# Altium schematic sheet FT2232Circuit.SchDoc
size A3
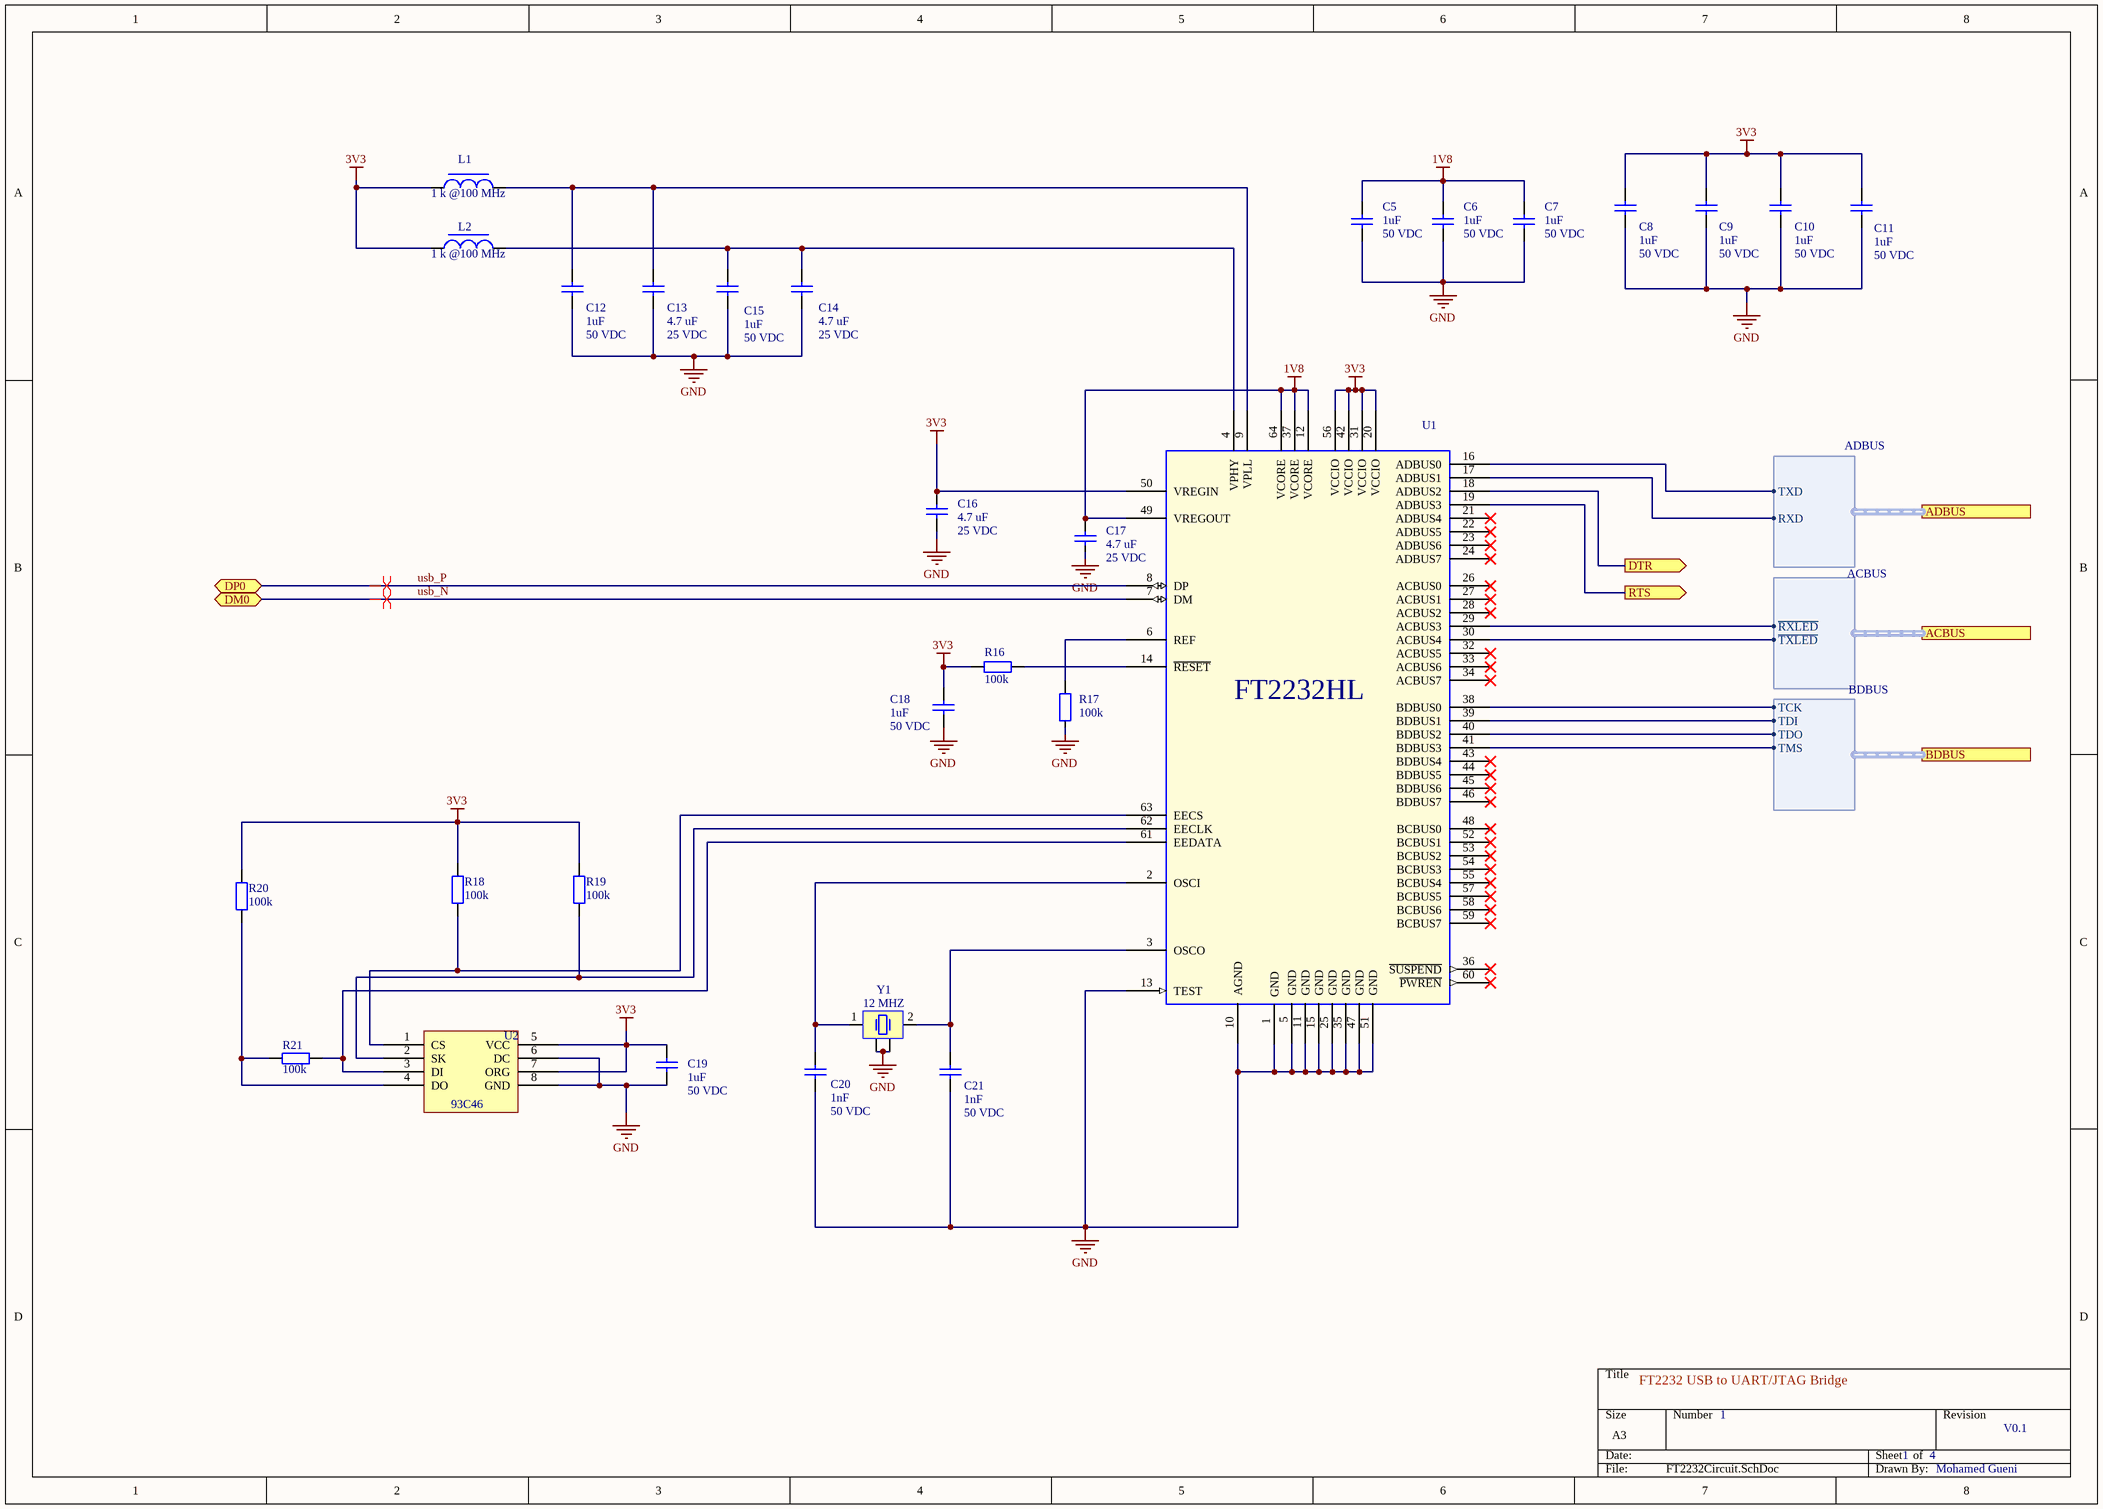
[diagram p0: FT2232Circuit.SchDoc]

## Parts
C5  Value 1: 1uF  Value 2: 50 VDC  [CAP-0603]  (hidden comment: Capacitor)
C6  Value 1: 1uF  Value 2: 50 VDC  [CAP-0603]  (hidden comment: Capacitor)
C7  Value 1: 1uF  Value 2: 50 VDC  [CAP-0603]  (hidden comment: Capacitor)
C8  Value 1: 1uF  Value 2: 50 VDC  [CAP-0603]  (hidden comment: Capacitor)
C9  Value 1: 1uF  Value 2: 50 VDC  [CAP-0603]  (hidden comment: Capacitor)
C10  Value 1: 1uF  Value 2: 50 VDC  [CAP-0603]  (hidden comment: Capacitor)
C11  Value 1: 1uF  Value 2: 50 VDC  [CAP-0603]  (hidden comment: Capacitor)
C12  Value 1: 1uF  Value 2: 50 VDC  [CAP-0603]  (hidden comment: Capacitor)
C13  Value 1: 4.7 uF  Value 2: 25 VDC  [CAP-0603]  (hidden comment: Capacitor)
C14  Value 1: 4.7 uF  Value 2: 25 VDC  [CAP-0603]  (hidden comment: Capacitor)
C15  Value 1: 1uF  Value 2: 50 VDC  [CAP-0603]  (hidden comment: Capacitor)
C16  Value 1: 4.7 uF  Value 2: 25 VDC  [CAP-0603]  (hidden comment: Capacitor)
C17  Value 1: 4.7 uF  Value 2: 25 VDC  [CAP-0603]  (hidden comment: Capacitor)
C18  Value 1: 1uF  Value 2: 50 VDC  [CAP-0603]  (hidden comment: Capacitor)
C19  Value 1: 1uF  Value 2: 50 VDC  [CAP-0603]  (hidden comment: Capacitor)
C20  Value 1: 1nF  Value 2: 50 VDC  [CAP-0603]  (hidden comment: Capacitor)
C21  Value 1: 1nF  Value 2: 50 VDC  [CAP-0603]  (hidden comment: Capacitor)
L1  Value 1: 1 k @100 MHz  [RESC3216X18N]  (hidden comment: MPZ1608S102A)
L2  Value 1: 1 k @100 MHz  [RESC3216X18N]  (hidden comment: MPZ1608S102A)
R16  Value 1: 100k  [R0603]  (hidden comment: Resistor)
R17  Value 1: 100k  [R0603]  (hidden comment: Resistor)
R18  Value 1: 100k  [R0603]  (hidden comment: Resistor)
R19  Value 1: 100k  [R0603]  (hidden comment: Resistor)
R20  Value 1: 100k  [R0603]  (hidden comment: Resistor)
R21  Value 1: 100k  [R0603]  (hidden comment: Resistor)
U1  FT2232HL-REEL  [TSQFP50P1200X1200X160-64N]  (value not drawn)
U2  93C46  [SOIC127P600X175-8N]  (value not drawn)
Y1  Value 1: 12 MHZ  [WE-4XTAL3.2x2.5mm]  (hidden comment: XTAL4)

## Ports
ACBUS (harness ACBUS), ADBUS (harness ADBUS), BDBUS (harness BDBUS), DM0 (bidir), DP0 (bidir), DTR (out), RTS (out)

## Harnesses
ADBUS: TXD, RXD
ACBUS: ~{RXLED}, ~{TXLED}
BDBUS: TCK, TDI, TDO, TMS

## Nets
1V8: C5.2 C6.2 C7.2 C17.2 U1.12(VCORE) U1.37(VCORE) U1.49(VREGOUT) U1.64(VCORE)
3V3: C8.2 C9.2 C10.2 C11.2 C16.2 C18.2 C19.2 L1.2 L2.2 R16.1 R18.2 R19.2 R20.2 U1.20(VCCIO) U1.31(VCCIO) U1.42(VCCIO) U1.50(VREGIN) U1.56(VCCIO) U2.5(VCC) U2.7(ORG)
GND: C5.1 C6.1 C7.1 C8.1 C9.1 C10.1 C11.1 C12.1 C13.1 C14.1 C15.1 C16.1 C17.1 C18.1 C19.1 C20.1 C21.1 R17.1 U1.1(GND) U1.5(GND) U1.10(AGND) U1.11(GND) U1.13(TEST) U1.15(GND) U1.25(GND) U1.35(GND) U1.47(GND) U1.51(GND) U2.6(DC) U2.8(GND) Y1.GND1 Y1.GND2
DTR: U1.18(ADBUS2) ; port DTR
RTS: U1.19(ADBUS3) ; port RTS
usb_N: U1.7(DM) ; port DM0
usb_P: U1.8(DP) ; port DP0
NetC12_2: C12.2 C13.2 L1.1 U1.9(VPLL)
NetC14_2: C14.2 C15.2 L2.1 U1.4(VPHY)
NetC20_2: C20.2 U1.2(OSCI) Y1.1(OSC1)
NetC21_2: C21.2 U1.3(OSCO) Y1.2(OSC2)
NetR16_2: R16.2 U1.14(~{RESET})
NetR17_2: R17.2 U1.6(REF)
NetR18_1: R18.1 U1.63(EECS) U2.1(CS)
NetR19_1: R19.1 U1.62(EECLK) U2.2(SK)
NetR20_1: R20.1 R21.2 U2.4(DO)
NetR21_1: R21.1 U1.61(EEDATA) U2.3(DI)
NetU1_16: U1.16(ADBUS0) ; port ADBUS.TXD
NetU1_17: U1.17(ADBUS1) ; port ADBUS.RXD
NetU1_29: U1.29(ACBUS3) ; port ACBUS.~{RXLED}
NetU1_30: U1.30(ACBUS4) ; port ACBUS.~{TXLED}
NetU1_38: U1.38(BDBUS0) ; port BDBUS.TCK
NetU1_39: U1.39(BDBUS1) ; port BDBUS.TDI
NetU1_40: U1.40(BDBUS2) ; port BDBUS.TDO
NetU1_41: U1.41(BDBUS3) ; port BDBUS.TMS

Not connected (* = marked no-connect by the designer): U1 21(ADBUS4)* 22(ADBUS5)* 23(ADBUS6)* 24(ADBUS7)* 26(ACBUS0)* 27(ACBUS1)* 28(ACBUS2)* 32(ACBUS5)* 33(ACBUS6)* 34(ACBUS7)* 36(~{SUSPEND})* 43(BDBUS4)* 44(BDBUS5)* 45(BDBUS6)* 46(BDBUS7)* 48(BCBUS0)* 52(BCBUS1)* 53(BCBUS2)* 54(BCBUS3)* 55(BCBUS4)* 57(BCBUS5)* 58(BCBUS6)* 59(BCBUS7)* 60(~{PWREN})*

## Layout directives
differential pair: usb_N, usb_P

## Notes on the sheet
- FT2232 USB to UART/JTAG Bridge
- 1
- 4
- V0.1
- Mohamed Gueni
- (in symbol U-000000002) FT2232HL

## Library data of the parts
C5-C12 C15 C18 C19 = C-000000011: DES: Multilayer Ceramic Capacitors MLCC - SMD/SMT Automotive Grade,MLCC,0603,X7R,50V,1uF,+/-10%,0.8mm; MAN: TDK; MANREF: CGA3E3X7R1H105K080AB; SUP: Mouser; SUPREF: 810-CGA3E3X7R1H105K0; TOL: 10%; FTP: 0603; NOTE: _; Part Number: C-000000011
C13 C14 = C-000000007: MAN: Multilayer Ceramic Capacitors MLCC - SMD/SMT 0603 25Vdc 4.7uF X6S 10%; MANREF: Murata Electronics; DES: GRT188C81E475KE13D; TOL: 10%; FTP: 0603; SUP: Mouser; SUPREF: 81-GRT188C81E475KE3D; NOTE: _; Part Number: C-000000007
C16 C17 = C-000000007: DES: GRT188C81E475KE13D; MAN: Multilayer Ceramic Capacitors MLCC - SMD/SMT 0603 25Vdc 4.7uF X6S 10%; MANREF: Murata Electronics; SUP: Mouser; SUPREF: 81-GRT188C81E475KE3D; TOL: 10%; FTP: 0603; NOTE: _; Part Number: C-000000007
C20 C21 = C-000000010: DES: C0603C102K5RECTU; MAN: Multilayer Ceramic Capacitors MLCC - SMD/SMT 50V 1000pF 0603 X7R 0.1; MANREF: KEMET; SUP: Mouser; SUPREF: 80-C0603C102K5REC; TOL: 10%; FTP: 0603; NOTE: _; Part Number: C-000000010
L1 L2 = L-000000001: DES: Ferrite Beads 1000ohms 0.3ohms 0.8A; MAN: TDK; SUP: Mouser; SUPREF: 810-MPZ1608S102A; Value 2: 800 mA; N°: L-000000001; MANREF: MPZ1608S102A; Footprint: 0603 (1608 metric); DataSheet: https://eu.mouser.com/datasheet/2/400/eads_commercial_power_mpz1608_en-923650.pdf
R16-R21 = R-000000002: TOL: 1 %; DES: Thick Film Resistors - SMD 1/10watt 100Kohms 1%; MAN: Vishay; MANREF: CRCW0603100KFKEA; SUP: Mouser; SUPREF: 71-CRCW0603-100K-E3; Value 2: 100 mW; Part Number: R-000000002; FTP: R0603; NOTE: -
U1 = U-000000002: MAN: USB Interface IC USB HS to Dual UART/ FIFO/SPI/JTAG/I2C; MANREF: FTDI; Value 1: Mouser; Value 2: LQFP-64; TOL: 895-FT2232HL; DES: FT2232HL-REEL; Part Number: U-000000002; NOTE: https://eu.mouser.com/datasheet/2/163/DS_FT2232H-17353.pdf
U2 = U-000000003: DES: 93C46B-I/SN; MAN: EEPROM 64x16; MANREF: Microchip Technology; Value 1: Mouser; Value 2: SOIC-8; TOL: 579-93C46B-I/SN; Part Number: U-000000003; NOTE: https://eu.mouser.com/datasheet/2/268/20001749K-277859.pdf
Y1 = Y-000000002: TOL: 10 PPM; DES: Crystals WE-XTAL 12.0MHz 10ppm 3.2 x 2.5mm; MAN: Wurth Elektronik; MANREF: 830105420809; SUP: Mouser; SUPREF: 710-830105420809; Value 2: 10 Pf; N°: Y-000000002; Footprint: 3.2 mm x 2.5 mm; DataSheet: https://www.we-online.com/components/products/datasheet/830105420809.pdf